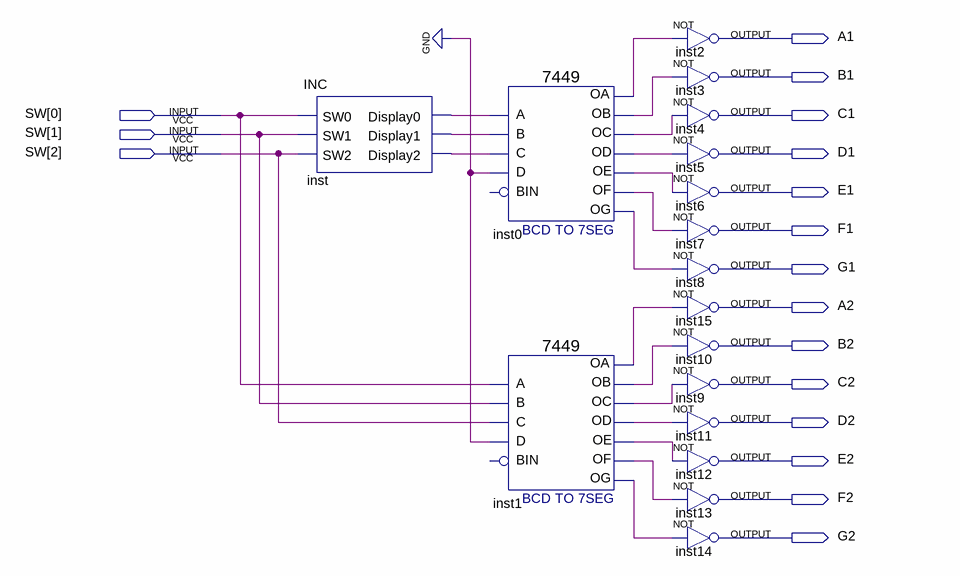
[diagram p0: schematic sheet]
// Quartus schematic TAREA1_D.bdf as structural Verilog: 17 symbols, 17 pins
module TAREA1_D (
  input  [2:0] SW,
  output A1,
  output B1,
  output C1,
  output D1,
  output E1,
  output F1,
  output G1,
  output A2,
  output B2,
  output C2,
  output D2,
  output E2,
  output F2,
  output G2
);

  wire inst0_oa, inst0_ob, inst0_oc, inst0_od, inst0_oe, inst0_of, inst0_og, inst1_oa, inst1_ob, inst1_oc,
       inst1_od, inst1_oe, inst1_of, inst1_og, inst_display0, inst_display1, inst_display2;

  INC inst (
    .SW0(SW[0]), .SW1(SW[1]), .SW2(SW[2]), .Display0(inst_display0), .Display1(inst_display1),
    .Display2(inst_display2));
  \7449  inst0 (
    .A(inst_display0), .C(inst_display2), .B(inst_display1), .D(1'b0), .OC(inst0_oc), .OD(inst0_od),
    .OF(inst0_of), .OG(inst0_og), .OB(inst0_ob), .OA(inst0_oa), .OE(inst0_oe));  // open: BIN
  \7449  inst1 (
    .A(SW[0]), .C(SW[2]), .B(SW[1]), .D(1'b0), .OC(inst1_oc), .OD(inst1_od), .OF(inst1_of), .OG(inst1_og),
    .OB(inst1_ob), .OA(inst1_oa), .OE(inst1_oe));  // open: BIN
  not inst2 (A1, inst0_oa);
  not inst3 (B1, inst0_ob);
  not inst4 (C1, inst0_oc);
  not inst5 (D1, inst0_od);
  not inst6 (E1, inst0_oe);
  not inst7 (F1, inst0_of);
  not inst8 (G1, inst0_og);
  not inst15 (A2, inst1_oa);
  not inst10 (B2, inst1_ob);
  not inst9 (C2, inst1_oc);
  not inst11 (D2, inst1_od);
  not inst12 (E2, inst1_oe);
  not inst13 (F2, inst1_of);
  not inst14 (G2, inst1_og);
endmodule
